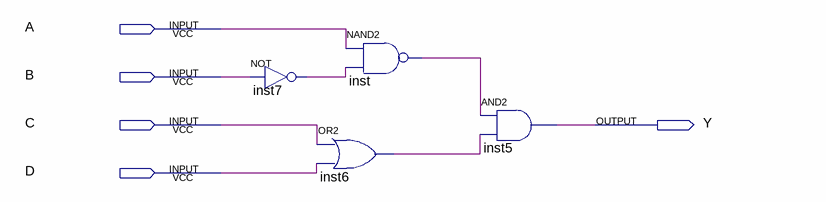
[diagram p0: schematic sheet]
// Quartus schematic Ex1.bdf as structural Verilog: 4 symbols, 5 pins
module Ex1 (
  input  A,
  input  B,
  input  C,
  input  D,
  output Y
);

  wire inst6_out, inst7_out, inst_out;

  not inst7 (inst7_out, B);
  nand inst (inst_out, A, inst7_out);
  or inst6 (inst6_out, C, D);
  and inst5 (Y, inst_out, inst6_out);
endmodule
